# Altium schematic sheet GTM_BallGrippersCircuits.SchDoc
size A3
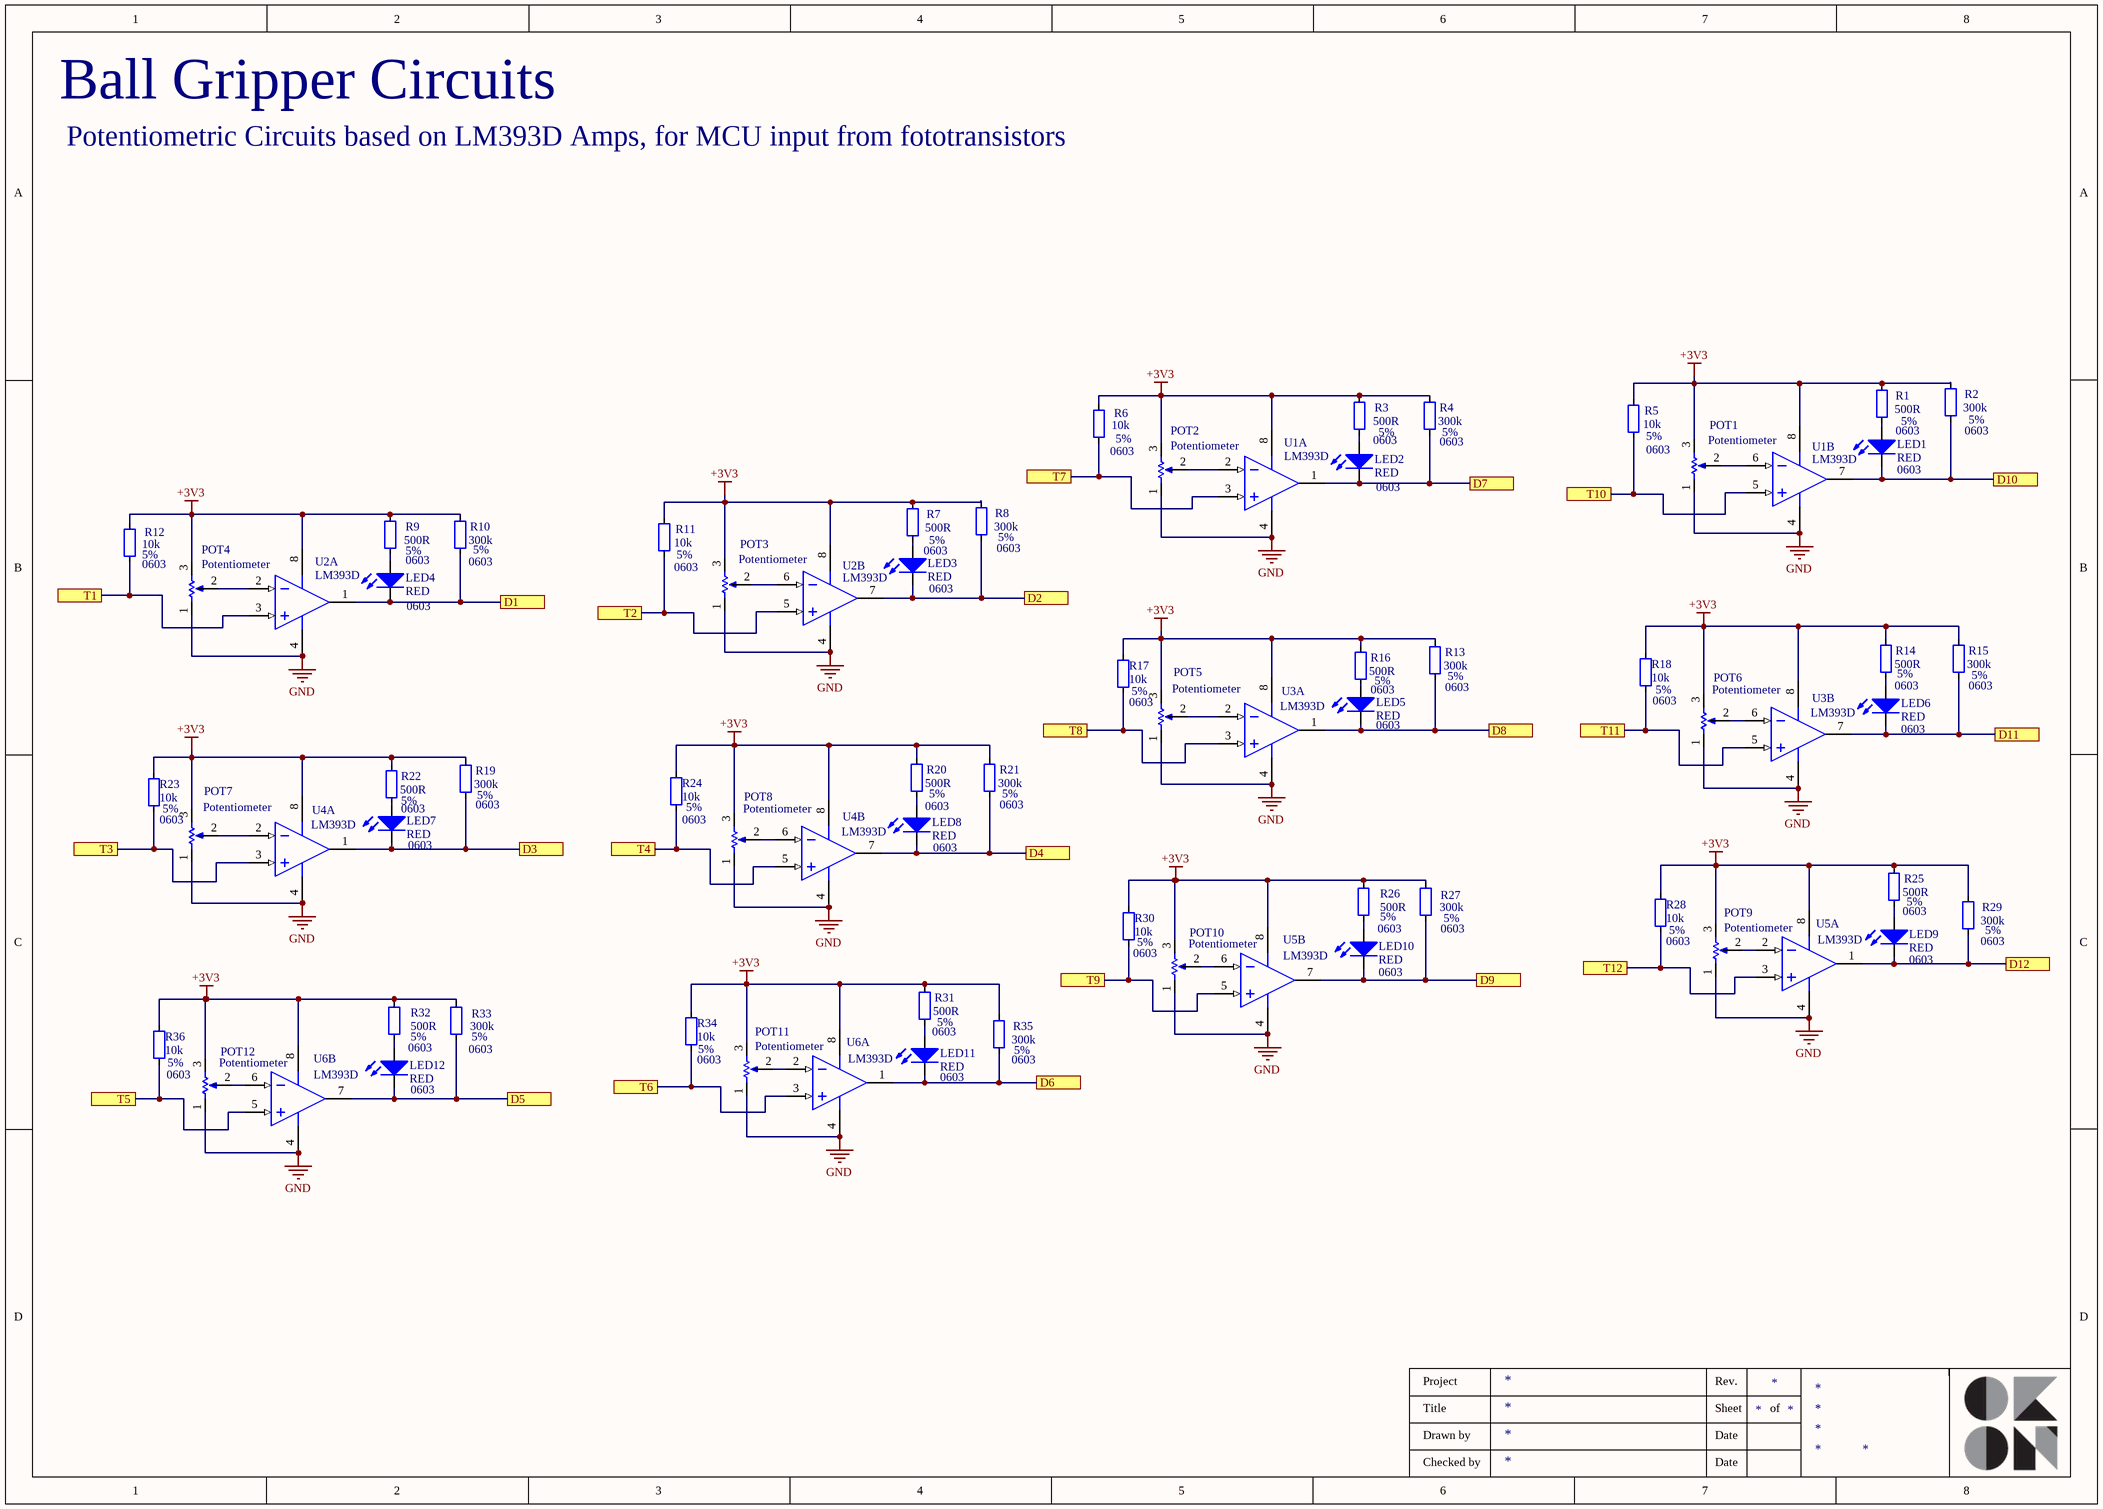
[diagram p0: GTM_BallGrippersCircuits.SchDoc]

## Parts
LED1  RED  Package: 0603  [0603_led_red]
LED2  RED  Package: 0603  [0603_led_red]
LED3  RED  Package: 0603  [0603_led_red]
LED4  RED  Package: 0603  [0603_led_red]
LED5  RED  Package: 0603  [0603_led_red]
LED6  RED  Package: 0603  [0603_led_red]
LED7  RED  Package: 0603  [0603_led_red]
LED8  RED  Package: 0603  [0603_led_red]
LED9  RED  Package: 0603  [0603_led_red]
LED10  RED  Package: 0603  [0603_led_red]
LED11  RED  Package: 0603  [0603_led_red]
LED12  RED  Package: 0603  [0603_led_red]
POT1  Potentiometer  [Pot_3296]
POT2  Potentiometer  [Pot_3296]
POT3  Potentiometer  [Pot_3296]
POT4  Potentiometer  [Pot_3296]
POT5  Potentiometer  [Pot_3296]
POT6  Potentiometer  [Pot_3296]
POT7  Potentiometer  [Pot_3296]
POT8  Potentiometer  [Pot_3296]
POT9  Potentiometer  [Pot_3296]
POT10  Potentiometer  [Pot_3296]
POT11  Potentiometer  [Pot_3296]
POT12  Potentiometer  [Pot_3296]
R1  Tolerance: 5%  [0603]  (hidden comment: 500R)
R2  Tolerance: 5%  [0603]  (hidden comment: 300k)
R3  Tolerance: 5%  [0603]  (hidden comment: 500R)
R4  Tolerance: 5%  [0603]  (hidden comment: 300k)
R5  Tolerance: 5%  [0603]  (hidden comment: 10k)
R6  Tolerance: 5%  [0603]  (hidden comment: 10k)
R7  Tolerance: 5%  [0603]  (hidden comment: 500R)
R8  Tolerance: 5%  [0603]  (hidden comment: 300k)
R9  Tolerance: 5%  [0603]  (hidden comment: 500R)
R10  Tolerance: 5%  [0603]  (hidden comment: 300k)
R11  Tolerance: 5%  [0603]  (hidden comment: 10k)
R12  Tolerance: 5%  [0603]  (hidden comment: 10k)
R13  Tolerance: 5%  [0603]  (hidden comment: 300k)
R14  Tolerance: 5%  [0603]  (hidden comment: 500R)
R15  Tolerance: 5%  [0603]  (hidden comment: 300k)
R16  Tolerance: 5%  [0603]  (hidden comment: 500R)
R17  Tolerance: 5%  [0603]  (hidden comment: 10k)
R18  Tolerance: 5%  [0603]  (hidden comment: 10k)
R19  Tolerance: 5%  [0603]  (hidden comment: 300k)
R20  Tolerance: 5%  [0603]  (hidden comment: 500R)
R21  Tolerance: 5%  [0603]  (hidden comment: 300k)
R22  Tolerance: 5%  [0603]  (hidden comment: 500R)
R23  Tolerance: 5%  [0603]  (hidden comment: 10k)
R24  Tolerance: 5%  [0603]  (hidden comment: 10k)
R25  Tolerance: 5%  [0603]  (hidden comment: 500R)
R26  Tolerance: 5%  [0603]  (hidden comment: 500R)
R27  Tolerance: 5%  [0603]  (hidden comment: 300k)
R28  Tolerance: 5%  [0603]  (hidden comment: 10k)
R29  Tolerance: 5%  [0603]  (hidden comment: 300k)
R30  Tolerance: 5%  [0603]  (hidden comment: 10k)
R31  Tolerance: 5%  [0603]  (hidden comment: 500R)
R32  Tolerance: 5%  [0603]  (hidden comment: 500R)
R33  Tolerance: 5%  [0603]  (hidden comment: 300k)
R34  Tolerance: 5%  [0603]  (hidden comment: 10k)
R35  Tolerance: 5%  [0603]  (hidden comment: 300k)
R36  Tolerance: 5%  [0603]  (hidden comment: 10k)
U1  LM393D  [SO8_N]  (parts A,B of 2)
U2  LM393D  [SO8_N]  (parts A,B of 2)
U3  LM393D  [SO8_N]  (parts A,B of 2)
U4  LM393D  [SO8_N]  (parts A,B of 2)
U5  LM393D  [SO8_N]  (parts A,B of 2)
U6  LM393D  [SO8_N]  (parts A,B of 2)

## Ports
D1, D2, D3, D4, D5, D6, D7, D8, D9, D10, D11, D12, T1, T2, T3, T4, T5, T6, T7, T8, T9, T10, T11, T12

## Nets
+3V3: POT1.3 POT2.3 POT3.3 POT4.3 POT5.3 POT6.3 POT7.3 POT8.3 POT9.3 POT10.3 POT11.3 POT12.3 R1.2 R2.2 R3.2 R4.2 R5.2 R6.2 R7.2 R8.2 R9.2 R10.2 R11.2 R12.2 R13.2 R14.2 R15.2 R16.2 R17.2 R18.2 R19.2 R20.2 R21.2 R22.2 R23.2 R24.2 R25.2 R26.2 R27.2 R28.2 R29.2 R30.2 R31.2 R32.2 R33.2 R34.2 R35.2 R36.2 U1.8(V+) U2.8(V+) U3.8(V+) U4.8(V+) U5.8(V+) U6.8(V+)
GND: POT1.1 POT2.1 POT3.1 POT4.1 POT5.1 POT6.1 POT7.1 POT8.1 POT9.1 POT10.1 POT11.1 POT12.1 U1.4(V-) U2.4(V-) U3.4(V-) U4.4(V-) U5.4(V-) U6.4(V-)
D1: LED4.2(K) R10.1 U2.1(OUT) ; port D1
D2: LED3.2(K) R8.1 U2.7(OUT) ; port D2
D3: LED7.2(K) R19.1 U4.1(OUT) ; port D3
D4: LED8.2(K) R21.1 U4.7(OUT) ; port D4
D5: LED12.2(K) R33.1 U6.7(OUT) ; port D5
D6: LED11.2(K) R35.1 U6.1(OUT) ; port D6
D7: LED2.2(K) R4.1 U1.1(OUT) ; port D7
D8: LED5.2(K) R13.1 U3.1(OUT) ; port D8
D9: LED10.2(K) R27.1 U5.7(OUT) ; port D9
D10: LED1.2(K) R2.1 U1.7(OUT) ; port D10
D11: LED6.2(K) R15.1 U3.7(OUT) ; port D11
D12: LED9.2(K) R29.1 U5.1(OUT) ; port D12
T1: R12.1 U2.3(IN+) ; port T1
T2: R11.1 U2.5(IN+) ; port T2
T3: R23.1 U4.3(IN+) ; port T3
T4: R24.1 U4.5(IN+) ; port T4
T5: R36.1 U6.5(IN+) ; port T5
T6: R34.1 U6.3(IN+) ; port T6
T7: R6.1 U1.3(IN+) ; port T7
T8: R17.1 U3.3(IN+) ; port T8
T9: R30.1 U5.5(IN+) ; port T9
T10: R5.1 U1.5(IN+) ; port T10
T11: R18.1 U3.5(IN+) ; port T11
T12: R28.1 U5.3(IN+) ; port T12
NetLED1_1: LED1.1(A) R1.1
NetLED2_1: LED2.1(A) R3.1
NetLED3_1: LED3.1(A) R7.1
NetLED4_1: LED4.1(A) R9.1
NetLED5_1: LED5.1(A) R16.1
NetLED6_1: LED6.1(A) R14.1
NetLED7_1: LED7.1(A) R22.1
NetLED8_1: LED8.1(A) R20.1
NetLED9_1: LED9.1(A) R25.1
NetLED10_1: LED10.1(A) R26.1
NetLED11_1: LED11.1(A) R31.1
NetLED12_1: LED12.1(A) R32.1
NetPOT1_2: POT1.2 U1.6(IN-)
NetPOT2_2: POT2.2 U1.2(IN-)
NetPOT3_2: POT3.2 U2.6(IN-)
NetPOT4_2: POT4.2 U2.2(IN-)
NetPOT5_2: POT5.2 U3.2(IN-)
NetPOT6_2: POT6.2 U3.6(IN-)
NetPOT7_2: POT7.2 U4.2(IN-)
NetPOT8_2: POT8.2 U4.6(IN-)
NetPOT9_2: POT9.2 U5.2(IN-)
NetPOT10_2: POT10.2 U5.6(IN-)
NetPOT11_2: POT11.2 U6.2(IN-)
NetPOT12_2: POT12.2 U6.6(IN-)

## Notes on the sheet
- Ball Gripper Circuits
- Potentiometric Circuits based on LM393D Amps, for MCU input from fototransistors
- Project
- Rev.
- Title
- Drawn by
- Date
- Sheet
- of
- Checked by

## Library data of the parts
LED1-LED12 = LED: Light-emitting diode; COLOR: RED
R1-R36 = RES: Resistior; Package: 0603
  R1 R3 R7 R9 R14 R16 R20 R22 R25 R26 R31 R32: Value: 500R
  R2 R4 R8 R10 R13 R15 R19 R21 R27 R29 R33 R35: Value: 300k
  R5 R6 R11 R12 R17 R18 R23 R24 R28 R30 R34 R36: Value: 10k
U1-U6 = LM393D: Low-Power Dual Voltage Comparator; Published: 24-Aug-2001; LatestRevisionDate: 13-Apr-2006; LatestRevisionNote: IPC-7351 Footprint Added.; DatasheetVersion: Jun-1998; PackageVersion: Dec-2002; PackageReference: SO8; Publisher: Altium Limited; PackageDescription: 8-Pin Small Outline Integrated Circuit 1.27 mm Pitch; Code_JEDEC: MS-012-AA; Code_IPC: SOIC127P600-8; ComponentLink1Description: Manufacturer Link; ComponentLink1URL: http://www.st.com/; ComponentLink2Description: Datasheet; ComponentLink2URL: http://www.st.com/stonline/products/literature/ds/2164/lm293.pdf